# EAGLE design ESPIR (EAGLE 9.2.2)
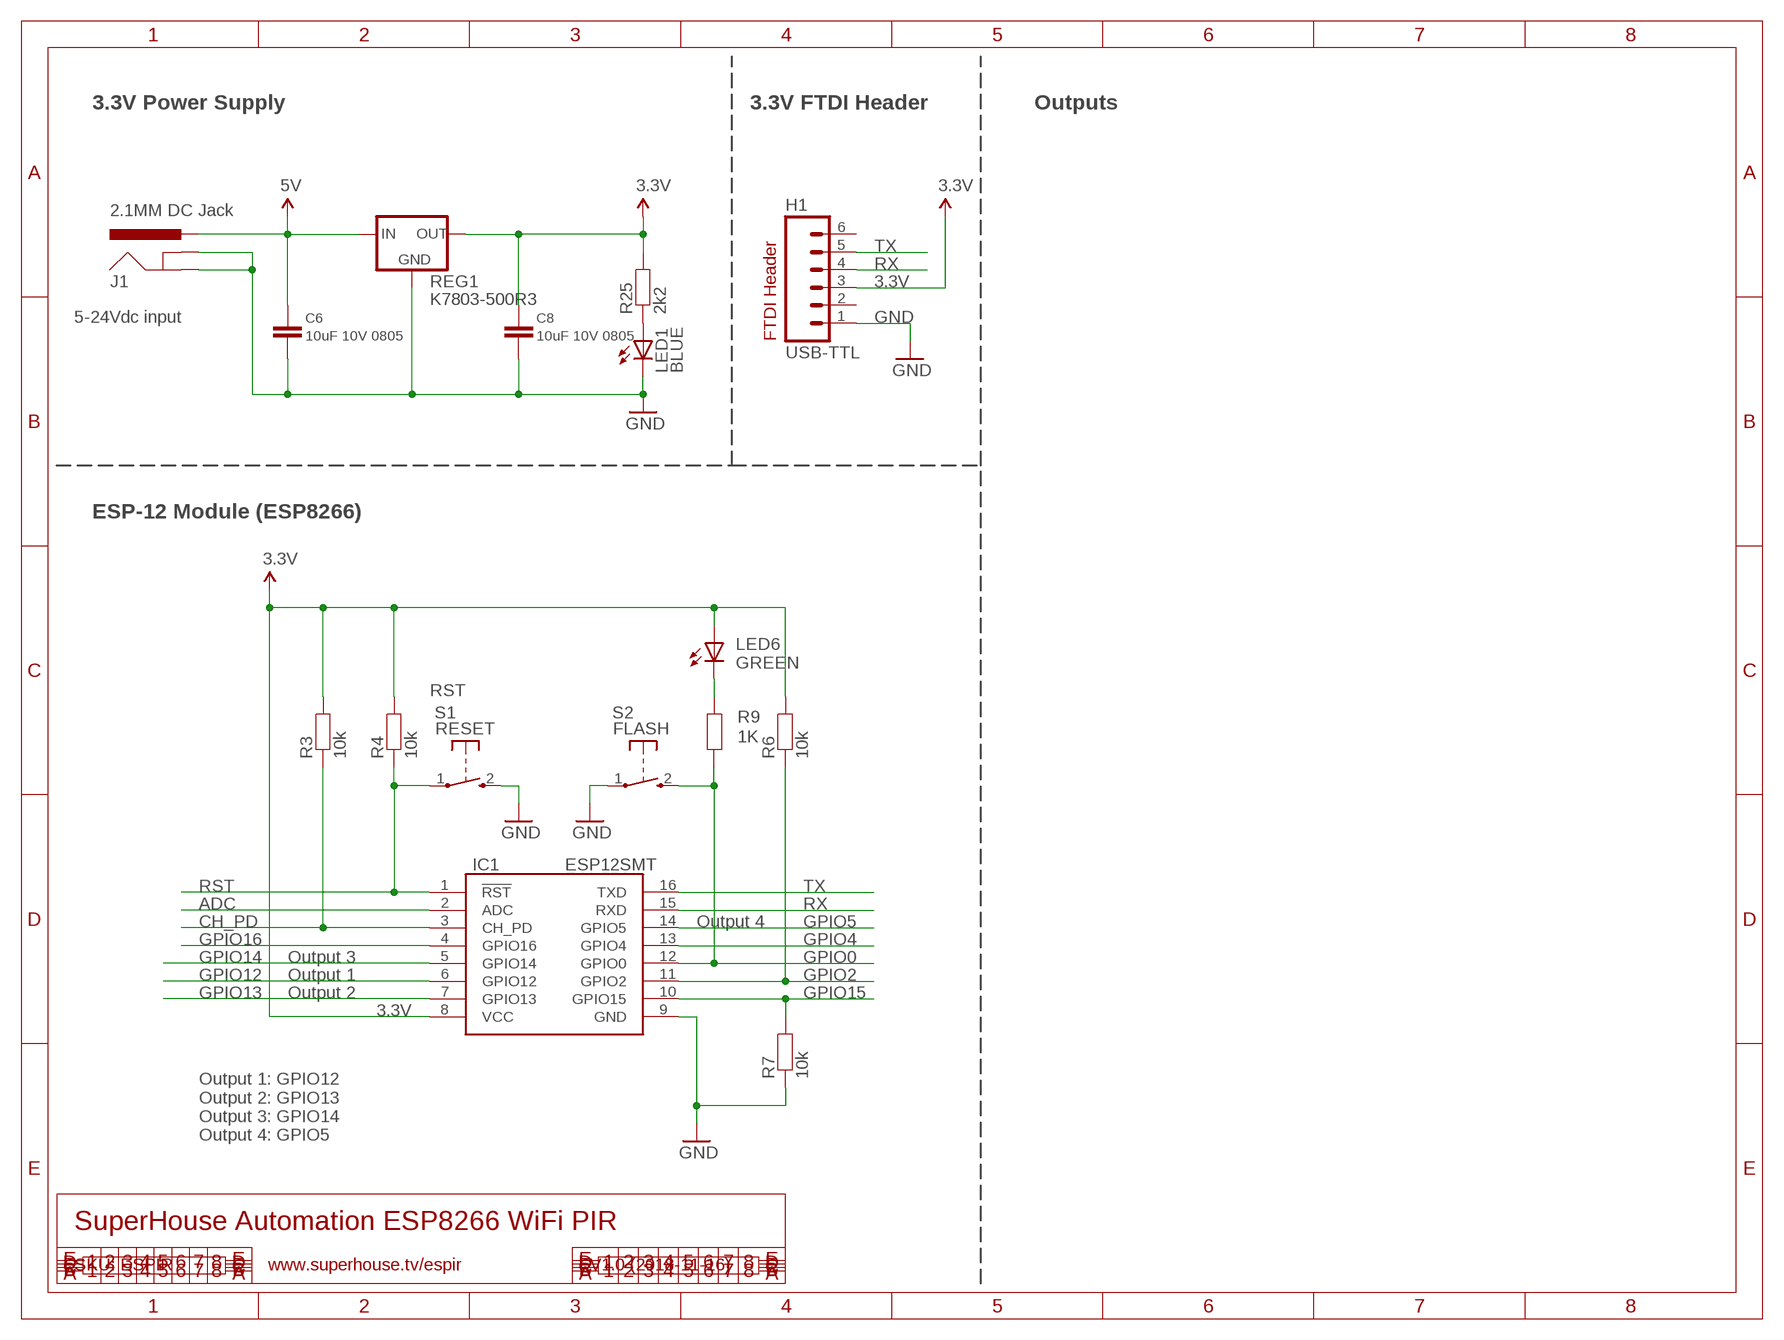
[diagram p0: schematic, sheet 1]

## Parts
C6  10uF 10V 0805  C-EUC0805  [C0805]
C8  10uF 10V 0805  C-EUC0805  [C0805]
H1  USB-TTL  M06SIP  [1X06]
IC1  ESP12SMT  [ESP12]
J1  2.1MM DC Jack  POWER_JACKPTH_SLOTS  [POWER_JACK_PTH_SLOTS]
LED1  BLUE  LED0603  [LED-0603]
LED6  GREEN  LED0603  [LED-0603]
R3  10k  RESISTOR0603  [0603]
R4  10k  RESISTOR0603  [0603]
R6  10k  RESISTOR0603  [0603]
R7  10k  RESISTOR0603  [0603]
R9  1K  RESISTOR0603  [0603]
R25  2k2  RESISTOR0603  [0603]
REG1  K7803-500R3  K78XX-500R3  [K78XX-500R3]
S1  RESET  TAC_SWITCH_2PINSMT  [TACTILE_SWITCH_SMD_2PIN_TINY]
S2  FLASH  TAC_SWITCH_2PINSMT  [TACTILE_SWITCH_SMD_2PIN_TINY]

## Nets
3.3V: C8.1 H1.3 IC1.8(VCC) LED6.A R3.2 R4.2 R6.2 R25.2 REG1.3(OUT)
5V: C6.1 J1.PWR REG1.1(IN)
ADC: IC1.2(ADC)
CH_PD: IC1.3(CH_PD) R3.1
GND: C6.2 C8.2 H1.1 IC1.9(GND) J1.GND J1.GNDBREAK LED1.C R7.1 REG1.2(GND) S1.2(S) S2.1(P)
GPIO0: IC1.12(GPIO0) R9.2 S2.2(S)
GPIO2: IC1.11(GPIO2) R6.1
GPIO4: IC1.13(GPIO4)
GPIO5: IC1.14(GPIO5)
GPIO12: IC1.6(GPIO12)
GPIO13: IC1.7(GPIO13)
GPIO14: IC1.5(GPIO14)
GPIO15: IC1.10(GPIO15) R7.2
GPIO16: IC1.4(GPIO16)
N$23: LED1.A R25.1
N$27: LED6.C R9.1
RST: IC1.1(!RST) R4.1 S1.1(P)
RX: H1.4 IC1.15(RXD)
TX: H1.5 IC1.16(TXD)
Unconnected: H1.2 H1.6

## Notes on the sheet
- 3.3V Power Supply | 3.3V FTDI Header | Outputs
- 5-24Vdc input
- FTDI Header
- ESP-12 Module (ESP8266)
- Output 4
- Output 3
- Output 1
- Output 2
- Output 1: GPIO12
  Output 2: GPIO13
  Output 3: GPIO14
  Output 4: GPIO5
- SuperHouse Automation ESP8266 WiFi PIR
- SKU: ESPIR | www.superhouse.tv/espir | V1.0 (2018-11-16)

## Library data of the parts
C6 C8 = freetronics-jon:C-EU: CAPACITOR, European symbol
H1 = freetronics:M06: Header 6 Standard 6-pin 0.1" header. Use with straight break away headers (SKU : PRT-00116), right angle break away headers (PRT-00553), swiss pins (PRT-00743), machine pins (PRT-00117), and female headers (PRT-00115). Molex polarized connector foot print use with SKU : PRT-08094 with associated crimp pins and housings. NOTES ON THE VARIANTS LOCK and LOCK_LONGPADS... This footprint was designed to help hold the alignment of a through-hole component (i.e. 6-pin header) while soldering it into place. You may notice that each hole has been shifted either up or down by 0.005 of an inch from it's more standard position (which is a perfectly straight line). This slight alteration caused the pins (the squares in the middle) to touch the edges of the holes. Because they are alternating, it causes a "brace" to hold the component in place. 0.005 has proven to be the perfect amount of "off-center" position when using our standard breakaway headers. Although looks a little odd when you look at the bare footprint, once you have a header in there, the alteration is very hard to notice. Also, if you push a header all the way into place, it is covered up entirely on the bottom side. This idea of altering the position of holes to aid alignment will be further integrated into the Sparkfun Library for other footprints. It can help hold any component with 3 or more connection pins.
IC1 = freetronics-jon:ESP12
J1 = freetronics-jon:POWER_JACK: Power Jack This is the standard 5.5mm barrel jack for power. The PTH is the most common, proven, reliable, footprint. All others are experimental. The Slot footprint only works if the mill layer is transmitted to the PCB fab house so be warned. Spark Fun Electronics SKU : PRT-00119. Mating wall wart : TOL-00298 (and others)
LED1 = freetronics-jon:LED: LEDs Standard schematic elements and footprints for 5mm, 3mm, 1206, and 0603 sized LEDs. 5mm - Spark Fun Electronics SKU : COM-00529 (and others)
LED6 = freetronics-master-v1:LED: LEDs Standard schematic elements and footprints for 5mm, 3mm, 1206, and 0603 sized LEDs. 5mm - Spark Fun Electronics SKU : COM-00529 (and others)
R3 R4 R6 R7 R25 = freetronics-jon:RESISTOR: Resistor Basic schematic elements and footprints for 0603, 1206, and PTH 1/10th watt (small) resistors.
R9 = freetronics-master-v1:RESISTOR: Resistor Basic schematic elements and footprints for 0603, 1206, and PTH 1/10th watt (small) resistors.
REG1 = freetronics-jon:K78XX-500R3
S1 S2 = freetronics-jon:TAC_SWITCH_2PIN: Momentary Tactile Switch - 2 pin

## Net classes
0 default: width 0.203 mm, drill 0.356 mm, clearance 0.152 mm
1 power: width 0.203 mm, clearance 0.152 mm

## Board
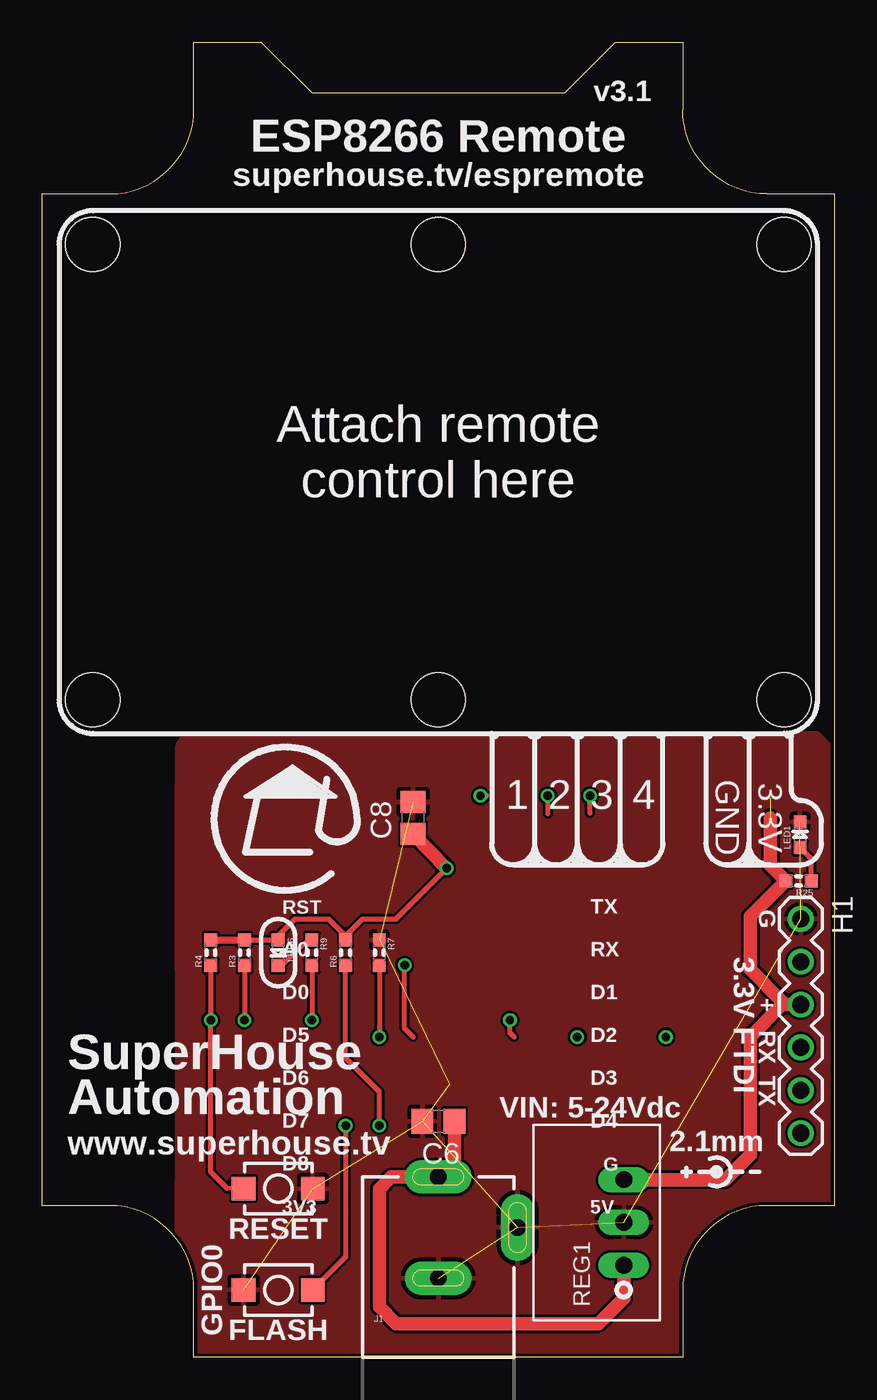
[diagram p1: board, top side]
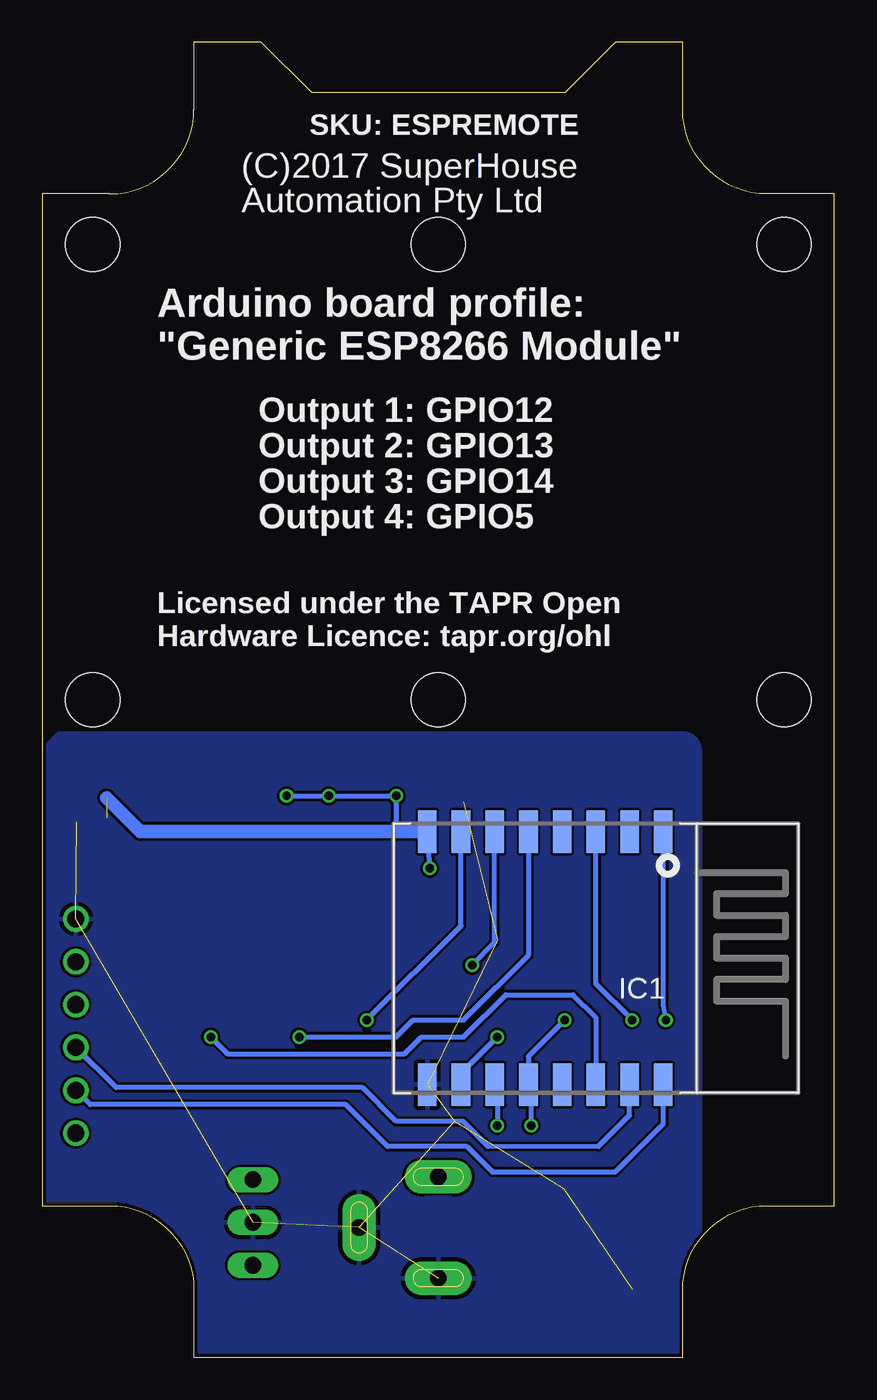
[diagram p2: board, bottom side, seen from below]

Size 47 x 78 mm. Coordinates in mm from the lower left corner, seen from the top.
Outline: 4,9 0,9 0,69 4,69 arc90 9,74 9,78 13,78 16,75 31,75 34,78 38,78 38,74 arc90 43,69 47,69 47,9 43,9 arc90 38,4 38,0 9,0 9,4 arc90 4,9
Copper layers (1*16): Top 0.035mm / dielectric 1.5mm / Bottom 0.035mm
Design rules "ElectroDragon_2layer_DRU_no_angle_20140221": minimum track width 6mil, minimum drill 12mil, track to track 6mil, track to pad 6mil, pad to pad 6mil, via to via 6mil, smd to smd 6mil, copper to edge 8mil, drill to drill 6mil, minimum pad ring 10mil, minimum via ring 6mil, stop-mask expansion 4mil, vias tented up to drill 100mil, thermal gap 10mil
Holes 3.2 mm at 44,39 3,39 44,66 3,66 23.5,66 23.5,39

### Footprints (pad centres in the part's own frame; a part is rotated, then mirrored left to right if it is on the bottom)
C0805 = smd 1.3 x 1.5: 1 -0.95,0; 2 0.95,0
1X06 = drill 1.016: 1 0,0; 2 2.54,0; 3 5.08,0; 4 7.62,0; 5 10.16,0; 6 12.7,0
ESP12 = smd 1.1 x 2.5: 1 -4,-7.5; 2 -2,-7.5; 3 0,-7.5; 4 2,-7.5; 5 4,-7.5; 6 6,-7.5; 7 8,-7.5; 8 10,-7.5; 9 10,7.5; 10 8,7.5; 11 6,7.5; 12 4,7.5; 13 2,7.5; 14 0,7.5; 15 -2,7.5; 16 -4,7.5
POWER_JACK_PTH_SLOTS = drill 1 pad 2 long: GND 0,7.7; GNDBREAK 4.7,10.7; PWR 0,13.7
LED-0603 = smd 0.762 x 0.762: A -0.762,0; C 0.762,0
0603 = smd 0.762 x 0.762: 1 -0.762,0; 2 0.762,0
K78XX-500R3 = drill 1 long: 1 -2.54,0; 2 0,0; 3 2.54,0
TACTILE_SWITCH_SMD_2PIN_TINY = smd 1.4 x 1.4: 1 -2.05,0; 2 2.05,0

### Placement (x,y rotation side)
C6  23.5,14 180 top
C8  22,32 90 top
H1  45,26 270 top
IC1  14.15,23.68 180 bottom
J1  23.5,-3 0 top
LED1  44.96,31 90 top
LED6  14,24 270 top
R3  12,24 90 top
R4  10,24 90 top
R6  18,24 90 top
R7  20,24 270 top
R9  16,24 270 top
R25  44.87,28.26 180 top
REG1  34.5,8 90 top
S1  14,10 0 top
S2  14,4 0 top

### Tracks (layer width: path | path; a pad name or v marks a point on that pad's centre or on a via)
3.3V  (via drill 0.5)  (1 unrouted)
  Top 0.254: LED6.A 14,25 | 24,28.76 v24,29 | 42.94,31.76 43.18,32 | R6.2 18,25
  Top 0.305: R3.2 LED6.A | 14,25 15,26 17,26 18,25 19,26 21,26 v24,29 | 30,32.24 v30,33.3 | 32.5,32.28 v32.5,33.3 | 26.4,33.3 v26,33.3
  Top 0.406: R4.2 R3.2
  Top 0.813: 43.18,32 43.18,29.19 R25.2 42,26.15 42,23 43.92,21.08 43.92,20.92 | C8.1 v24,29 | 43.92,20.92 42,19 42,12 40.54,10.54 REG1.3 | 43.92,20.92 H1.3
  Bottom 0.305: 24,29.02 IC1.8 | 26,31.18 v26,33.3 v30,33.3 v32.5,33.3
  Bottom 0.406: v24,29 24,29.02
  Bottom 0.813: IC1.8 26,31.18 41.18,31.18 43.18,33.18
5V
  Top 0.813: C6.1 24.45,11.65 J1.PWR 20.7,10.7 20,10 20,3 21,2 33,2 34.5,3.5 REG1.1
CH_PD  (via drill 0.5)
  Top 0.305: R3.1 v12,20
  Bottom 0.305: v12,20 14.15,22.15 IC1.3
GND  (10 unrouted)
  pour Top: 7.98,7 arc-40 8.98,4 8.98,0 38,0 38,4 arc-90 43,9 47,9 47,36 46,37 9,37 arc90 8,36 7.98,32 8,14
  pour Bottom: 9,37 arc90 8,36 7.98,32 8,14 7.98,7 arc-40 8.98,4 8.98,0 38,0 38,4 arc-90 43,9 47,9 47,36 46,37
GPIO0  (via drill 0.5)
  Top 0.305: R9.2 v16,20 | S2.2 18,5.95 v18,13.75
  Bottom 0.254: IC1.12 18,16.02
  Bottom 0.305: 18,16.02 v18,13.75 | v16,20 18.15,17.85 IC1.12
GPIO2  (via drill 0.5)
  Top 0.305: R6.1 18,17.75 20,15.75 v20,13.75
  Bottom 0.254: IC1.11 20,16.02
  Bottom 0.305: 20,16.02 v20,13.75
GPIO5  (via drill 0.5)
  Bottom 0.305: v37,19 36,18 25.5,18 24.5,19 22,19 19.5,21.5 15.5,21.5 14.15,20.15 IC1.14
GPIO12  (via drill 0.5)
  Top 0.305: 22,19 21.5,19.5 v21.5,23.25
  Bottom 0.305: v21.5,23.25 20.15,24.6 IC1.6
GPIO13  (via drill 0.5)
  Top 0.305: 28,19 27.75,19.25 v27.75,20
  Bottom 0.305: v27.75,20 22.15,25.6 IC1.7
GPIO14  (via drill 0.5)
  Bottom 0.305: IC1.5 18.15,23.85 22,20 25,20 26,19 v31.75,19
GPIO15  (via drill 0.5)
  Top 0.305: R7.2 v20,19
  Bottom 0.254: 22.15,16.85 IC1.10
  Bottom 0.305: v20,19 22.15,16.85
N$23
  Top 0.305: R25.1 45.63,29.56 LED1.A
N$27
  Top 0.254: LED6.C 14.24,23.24 15.76,24.76 R9.1
RST  (via drill 0.5)
  Top 0.254: S1.1 11,10.05
  Top 0.305: R4.1 v10,20 10,11 11,10 11,10.05
  Bottom 0.254: v10,20 10.15,20.85
  Bottom 0.305: 10.15,20.85 IC1.1
RX
  Bottom 0.254: 20.55,12.5 14,12.5
  Bottom 0.305: 20.55,12.5 22.05,14 26,14 28,16 42.62,16 H1.4 | IC1.15 12.15,14.35 14,12.5
TX
  Bottom 0.305: IC1.16 10.15,13.85 13,11 20.3,11 21.8,12.5 26.5,12.5 29,15 44.16,15 H1.5

### Text on the board
tPlace: v3.1 | ESP8266 Remote | superhouse.tv/espremote | Attach remote / control here | 1 | 2 | 3 | 4 | GND | 3.3V | G | + | 3.3V FTDI | RX | TX | SuperHouse / Automation | VIN: 5-24Vdc | www.superhouse.tv | 2.1mm | RESET | GPIO0 | FLASH
bPlace: SKU: ESPREMOTE | (C)2017 SuperHouse / Automation Pty Ltd | Arduino board profile: / "Generic ESP8266 Module" | Output 1: GPIO12 / Output 2: GPIO13 / Output 3: GPIO14 / Output 4: GPIO5 | Licensed under the TAPR Open / Hardware Licence: tapr.org/ohl
tNames: RST | TX | A0 | RX | D0 | D1 | D5 | D2 | D6 | D3 | D7 | D4 | D8 | G | 3V3 | 5V